# Altium schematic sheet Sch.SchDoc: May cho meo an tu dong
size A4; Date: 9/10/2023; Author: MinhPC; DrawnBy: MinhPC; SheetNumber: 1; SheetTotal: 1; Time: 9-53
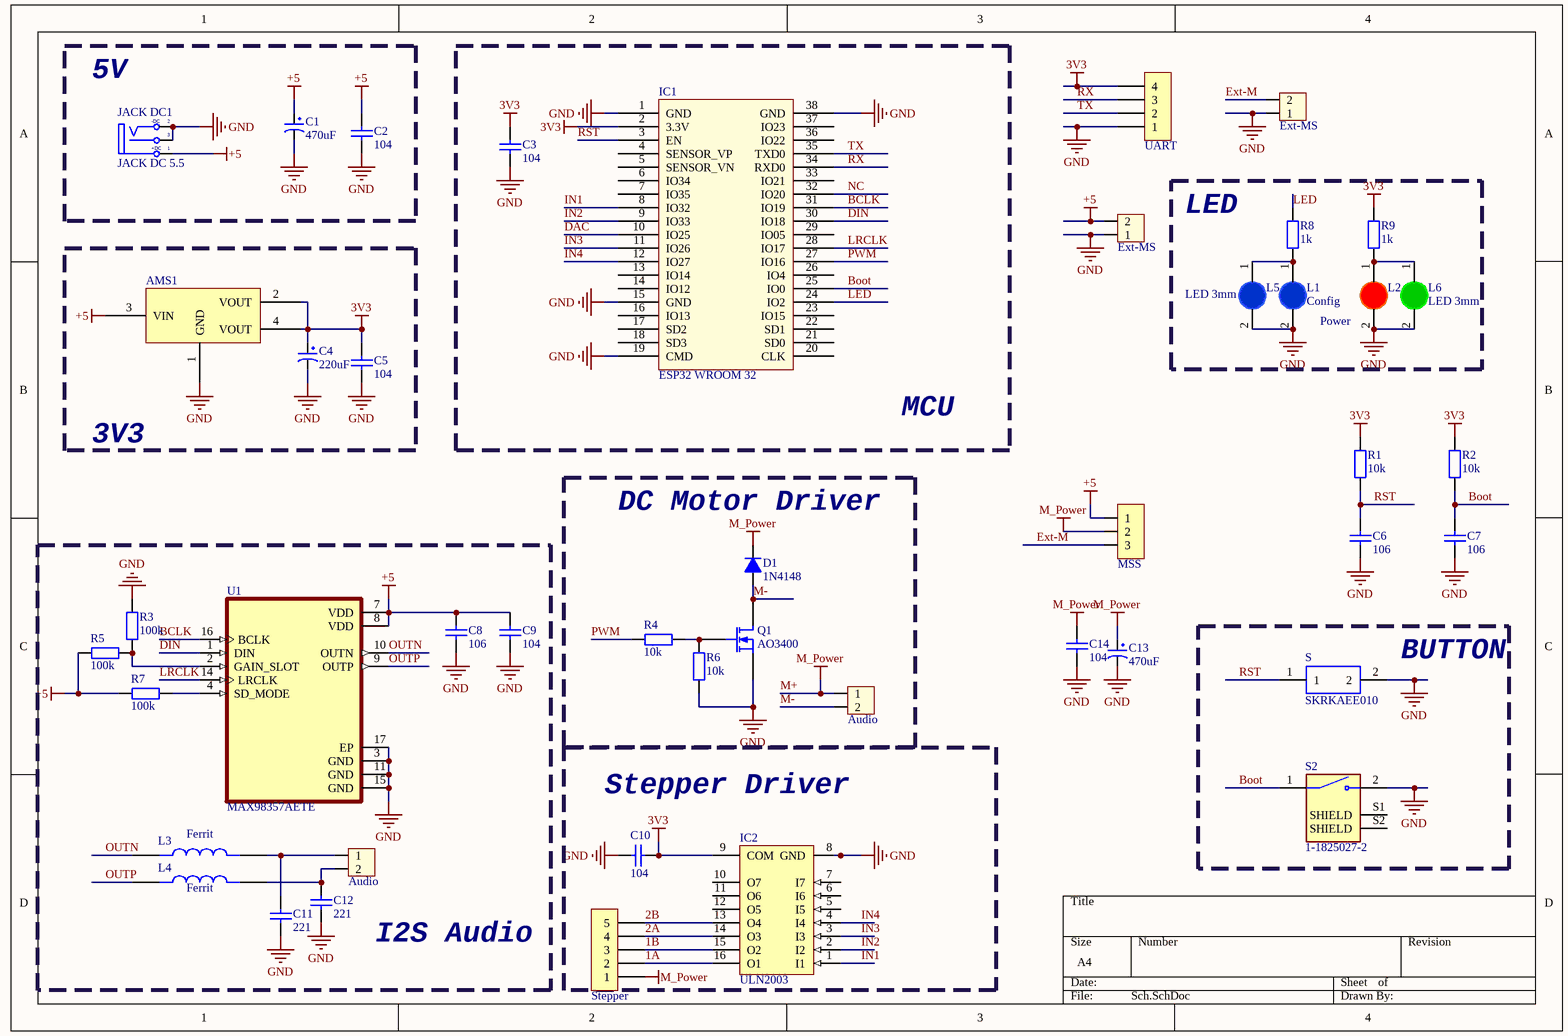
[diagram p0: Sch.SchDoc]

## Parts
AMS1  (no value)  [SOT223]
C1  470uF  [tu hoa 8mm]
C2  104  [tu 0805]
C3  104  [tu 0805]
C4  220uF  [tu hoa 5mm]
C5  104  [tu 0805]
C6  106  [tu 0805]
C7  106  [tu 0805]
C8  106  [tu 0805]
C9  104  [tu 0805]
C10  104  [tu 0805]
C11  221  [tu 0805]
C12  221  [tu 0805]
C13  470uF  [tu hoa 8mm]
C14  104  [tu 0805]
D1  1N4148  [DIODE SOD323F]
H1  UART  [XH2.54M-4]
H2  Audio  [XH2.54M-2]
H3  Audio  [XH2.54M-2]
H4  Stepper  [XH2.54M-5]
H5  Ext-MS  [XH2.54M-2]
H6  Ext-MS  [XH2.54M-2]
IC1  ESP32 WROOM 32  [ESP32-WROOM-32D]
IC2  ULN2003  [SOP 16]
JACK_DC1  JACK DC 5.5  [JACK DC 5.5]
JP1  MSS  [JP 1x3 DT]
L1  Config  [LED-0805-Blue]
L2  Power  [LED-0805-Red]
L3  Ferrit  [INDC2012X105N]
L4  Ferrit  [INDC2012X105N]
L5  LED 3mm  [LED-3MM-BLUE]
L6  LED 3mm  [LED-3MM-GREEN]
Q1  AO3400  [SOT23]
R1  10k  [tro smd 0805]
R2  10k  [tro smd 0805]
R3  100k  [tro smd 0805]
R4  10k  [tro smd 0805]
R5  100k  [tro smd 0805]
R6  10k  [tro smd 0805]
R7  100k  [tro smd 0805]
R8  1k  [tro smd 0805]
R9  1k  [tro smd 0805]
S  SKRKAEE010  [SKRK]
S2  1-1825027-2  [SW_1-1825027-2]
U1  MAX98357AETE  [QFN50P300X300X80-17N]

## Blocks framed on the sheet
5V: C1 C2 JACK_DC1
MCU: C3 IC1
LED: L1 L2 L5 L6 R8 R9
3V3: AMS1 C4 C5
DC Motor Driver: D1 H2 Q1 R4 R6
I2S Audio: C8 C9 C11 C12 H3 L3 L4 R3 R5 R7 U1
BUTTON: S S2
Stepper Driver: C10 H4 IC2

## Nets
3V3: AMS1.2(VOUT) AMS1.4(VOUT) C3.1 C4.1 C5.1 C10.1 H1.4 IC1.2(3.3V) IC2.9(COM) R1.2 R2.2 R9.2
+5: AMS1.3(VIN) C1.1 C2.1 C8.1 C9.1 H6.2 JACK_DC1.1(T) JP1.1 R5.2 R7.2 U1.7(VDD) U1.8(VDD)
GND: AMS1.1(GND) C1.2 C2.2 C3.2 C4.2 C5.2 C6.2 C7.2 C8.2 C9.2 C10.2 C11.2 C12.2 C13.2 C14.2 H1.1 H5.1 H6.1 IC1.1(GND) IC1.15(GND) IC1.19(CMD) IC1.38(GND) IC2.8(GND) JACK_DC1.2(TN) JACK_DC1.3(S) L1.2(K) L2.2(K) L5.2(K) L6.2(K) Q1.2(S) R3.2 R6.2 S.2 S2.2 U1.3(GND) U1.11(GND) U1.15(GND) U1.17(EP)
M+: C13.1 C14.1 D1.2(K) H2.1 H4.1 JP1.2  [also labelled M_Power]
1A: H4.2 IC2.16(O1)
1B: H4.3 IC2.15(O2)
2A: H4.4 IC2.14(O3)
2B: H4.5 IC2.13(O4)
BCLK: IC1.31(IO19) U1.16(BCLK)
Boot: C7.1 IC1.25(IO0) R2.1 S2.1
DAC: IC1.10(IO25)
DIN: IC1.30(IO18) U1.1(DIN)
Ext-M: H5.2 JP1.3
IN1: IC1.8(IO32) IC2.1(I1)
IN2: IC1.9(IO33) IC2.2(I2)
IN3: IC1.11(IO26) IC2.3(I3)
IN4: IC1.12(IO27) IC2.4(I4)
LED: IC1.24(IO2) R8.2
LRCLK: IC1.28(IO17) U1.14(LRCLK)
M-: D1.1(A) H2.2 Q1.3(D)
NC: IC1.32(IO20)
OUTN: L3.1 U1.10(OUTN)
OUTP: L4.1 U1.9(OUTP)
PWM: IC1.27(IO16) R4.2
RST: C6.1 IC1.3(EN) R1.1 S.1
RX: H1.3 IC1.34(RXD0)
TX: H1.2 IC1.35(TXD0)
NetC11_1: C11.1 H3.1 L3.2
NetC12_1: C12.1 H3.2 L4.2
NetL1_1: L1.1(A) L5.1(A) R8.1
NetL2_1: L2.1(A) L6.1(A) R9.1
NetQ1_1: Q1.1(G) R4.1 R6.1
NetR3_1: R3.1 R5.1 U1.2(GAIN_SLOT)
NetR7_1: R7.1 U1.4(SD_MODE)

Not connected (* = marked no-connect by the designer): IC1 4(SENSOR_VP) 5(SENSOR_VN) 6(IO34) 7(IO35) 13(IO14) 14(IO12) 16(IO13) 17(SD2) 18(SD3) 20(CLK) 21(SD0) 22(SD1) 23(IO15) 26(IO4) 29(IO05) 33(IO21) 36(IO22) 37(IO23); IC2 5(I5) 6(I6) 7(I7) 10(O7) 11(O6) 12(O5); S2 S1(SHIELD) S2(SHIELD)

## Notes on the sheet
- (in symbol JACK DC 5.5) -DC; +DC

## Library data of the parts
AMS1 = AMS1117 SMD: Dán; Value: AMS1117-3.3V SOT223; Don_Vi: Con; Ma_Hang: MH000596; Ghi_Chu: *; Kieu_Chan: *; Chung_Loai: Dán
C1 C13 = Tu Hoa 470uF 16V 8x11: Cắm; Don_Vi: Con; So_Chan: 2; Ten_Linh_Kien: Tụ Hóa 470uF 16V 8x11MM; Ma_Hang: MH006550; Chung_Loai: Cắm; Kieu_Chan: *
C2 C3 C5 C9 C10 C14 = Tu 0805 104 50V 10%: Dán; Don_Vi: Con; So_Chan: 2; Ten_Linh_Kien: Tụ 0805 104-100nF 10% 50V; Ma_Hang: MH004551; Chung_Loai: Dán; Kieu_Chan: *
C4 = Tu Hoa 220uF 10V 6x11: Cắm; Don_Vi: Con; So_Chan: 2; Ten_Linh_Kien: Tụ Hóa 220uF 10V 6x11MM; Ma_Hang: MH004510; Chung_Loai: Cắm; Kieu_Chan: *
C6-C8 = Tu 0805 106 16V 10%: Dán; Ten_Linh_Kien: Tụ 0805 106-10uF 10% 16V; So_Chan: 2; Don_Vi: Con; Ma_Hang: MH004553; Chung_Loai: Dán; Kieu_Chan: *
C11 C12 = Tu 0805 224 50V 10%: Dán; Don_Vi: Con; So_Chan: 2; Ten_Linh_Kien: Tụ 0805 224-0.22uF 10% 50V; Ma_Hang: MH004559; Chung_Loai: Dán; Kieu_Chan: *
D1 = 1N4148: SMD
H1 = Header 4P 2.54 Duc Thang: Cắm; Ten_Linh_Kien: Header 4P XH2.54-4P Đực Thẳng; Don_Vi: Con; Ma_Hang: MH001285; Chung_Loai: Cắm
H2 H3 H5 H6 = Header 2P 2.54 Duc Thang: Cắm; Ten_Linh_Kien: Header 2P XH2.54-2P Đực Thẳng; Don_Vi: Con; Ma_Hang: MH001283; Chung_Loai: Cắm
H4 = Header 5P 2.54 Duc Thang: Cắm; Ten_Linh_Kien: Header 5P XH2.54-5P Đực Thẳng; Don_Vi: Con; Ma_Hang: MH001298; Chung_Loai: Cắm
IC2 = ULN2003A SMD: Dán; Ten_Linh_Kien: ULN2003 SOP16; Don_Vi: Con; Ma_Hang: MH002408; Ghi_Chu: *; Chung_Loai: Dán; Kieu_Chan: *
JACK_DC1 = JACK DC 5.5: Value: Jac DC
JP1 = JP 1x3 2.54 Duc Thang: Cắm; Ten_Linh_Kien: Jump Đơn Đực 2.54MM 1x40P Thẳng 11MM; Don_Vi: Con; Ma_Hang: MH000903; Ghi_Chu: *; Kieu_Chan: *; Chung_Loai: Cắm
L1 = LED 0805 Xanh Duong: Dán; Don_Vi: Con; Ma_Hang: MH002327; Ten_Linh_Kien: LED 0805 Màu Xanh Dương (Blue); Ghi_Chu: *; Kieu_Chan: *; Chung_Loai: Dán
L2 = LED 0805 Do: Dán; Don_Vi: Con; Ma_Hang: MH000897; Ten_Linh_Kien: LED 0805 Màu Đỏ (Red); Ghi_Chu: *; Kieu_Chan: *; Chung_Loai: Dán
L3 L4 = AIML-0805-1R0K-T: IND 1uH 0.05A 400mâ„¦; MF: Abracon; Price: None; MP: AIML-0805-1R0K-T; Value: *; Purchase-URL: https://pricing.snapeda.com/search/part/AIML-0805-1R0K-T/?ref=eda; Package: 2012 Bourns; Check_prices: https://www.snapeda.com/parts/AIML-0805-1R0K-T/Abracon+LLC/view-part/?ref=eda; SnapEDA_Link: https://www.snapeda.com/parts/AIML-0805-1R0K-T/Abracon+LLC/view-part/?ref=snap; Availability: In Stock
L5 = LED 3mm Xanh Duong: Cắm; Don_Vi: Con; Ma_Hang: MH009003; Ten_Linh_Kien: LED 3MM Xanh Dương SS (1000c); Ghi_Chu: *; Kieu_Chan: *; Chung_Loai: Cắm
L6 = LED 3mm Xanh La: Cắm; Don_Vi: Con; Ma_Hang: MH001054; Ten_Linh_Kien: Led 3MM Phủ Xanh (10c); Ghi_Chu: *; Kieu_Chan: *; Chung_Loai: Cắm
Q1 = Si2302DS: N-Channel MOSFET; Published: 8-Jun-2000; LatestRevisionDate: 17-Jul-2002; LatestRevisionNote: Re-released for DXP Platform.; PackageVersion: 1995/1996; PackageReference: E3; Publisher: Altium Limited; PackageDescription: TO, Flat Index; 3 In-Line, Axial Leads; Body Dia. 4.6mm; Lead Dia. 0.5 mm (max)
R1-R9 = Tro 0805 5% 10k: Dán; Don_Vi: Con; So_Chan: 2; Ten_Linh_Kien: Trở 0805 5% 10k; Ma_Hang: MH005239; Chung_Loai: Dán; Kieu_Chan: *
S = SKRKAEE010: Switch Tactile N.O. SPST Round Button Gull Wing 0.05A 12VDC 1.57N SMD T/R; MF: ALPS; Availability: Unavailable; Price: None; Package: None; Value: *; SnapEDA_Link: https://www.snapeda.com/parts/SKRKAEE010/ALPS/view-part/380772/?ref=snap; MP: SKRKAEE010
S2 = 1-1825027-2: Tactile Switch SPST-NO Side Actuated Through Hole, Right Angle; MF: TE Connectivity; Availability: Good; Value: *; Check_prices: https://www.snapeda.com/parts/1-1825027-2/TE%20Connectivity%20ALCOSWITCH%20Switches/view-part/904477/?ref=eda; Package: None; Price: None; SnapEDA_Link: https://www.snapeda.com/parts/1-1825027-2/TE%20Connectivity%20ALCOSWITCH%20Switches/view-part/904477/?ref=snap; Purchase-URL: https://pricing.snapeda.com/search/part/1-1825027-2/?ref=eda; MP: 1-1825027-2
U1 = MAX98357AETE: Audio Amp Speaker 1-CH Mono 3.2W Class-D 16-Pin TQFN EP T/R; MF: Maxim Integrated; SnapEDA_Link: https://www.snapeda.com/parts/MAX98357AETE/Maxim+Integrated/view-part/?ref=snap; Check_prices: https://www.snapeda.com/parts/MAX98357AETE/Maxim+Integrated/view-part/?ref=eda; Package: None; Purchase-URL: https://pricing.snapeda.com/search/part/MAX98357AETE/?ref=eda; Price: None; Value: *; MP: MAX98357AETE; Availability: In Stock